# EAGLE design protect_clamp (EAGLE 9.2.2)
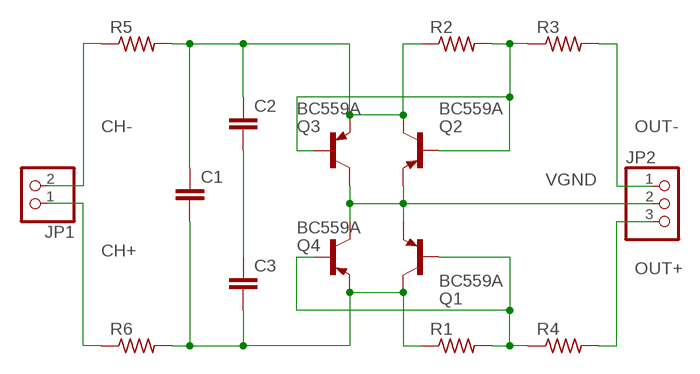
[diagram p0: schematic, sheet 1]

## Parts
C1  C2.5/2  [C2.5-2]
C2  C2.5/2  [C2.5-2]
C3  C2.5/2  [C2.5-2]
JP1  PINHD-1X2  [1X02]
JP2  PINHD-1X3  [1X03]
Q1  BC559A  [TO92-EBC]
Q2  BC559A  [TO92-EBC]
Q3  BC559A  [TO92-EBC]
Q4  BC559A  [TO92-EBC]
R1  R-US_0204/5  [0204/5]
R2  R-US_0204/5  [0204/5]
R3  R-US_0204/5  [0204/5]
R4  R-US_0204/5  [0204/5]
R5  R-US_0204/5  [0204/5]
R6  R-US_0204/5  [0204/5]

## Nets
CH+: JP1.1 R6.1
CH-: JP1.2 R5.1
N$2: Q1.B Q4.B R1.2 R4.1
N$3: Q2.B Q3.B R2.2 R3.1
N$4: C2.2 C3.1
N$6: C1.2 C3.2 Q1.C Q4.E R1.1 R6.2
N$7: C1.1 C2.1 Q2.C Q3.E R2.1 R5.2
OUT+: JP2.3 R4.2
OUT-: JP2.1 R3.2
VGND: JP2.2 Q1.E Q2.E Q3.C Q4.C

## Library data of the parts
C1-C3 = capacitor-wima:C: CAPACITOR naming: grid - package width
JP1 = pinhead:PINHD-1X2: PIN HEADER
JP2 = pinhead:PINHD-1X3: PIN HEADER
Q1-Q4 = transistor-pnp:BC559*: PNP Transistror
R1-R6 = rcl:R-US_: RESISTOR, American symbol; SPICEPREFIX: R

## Board
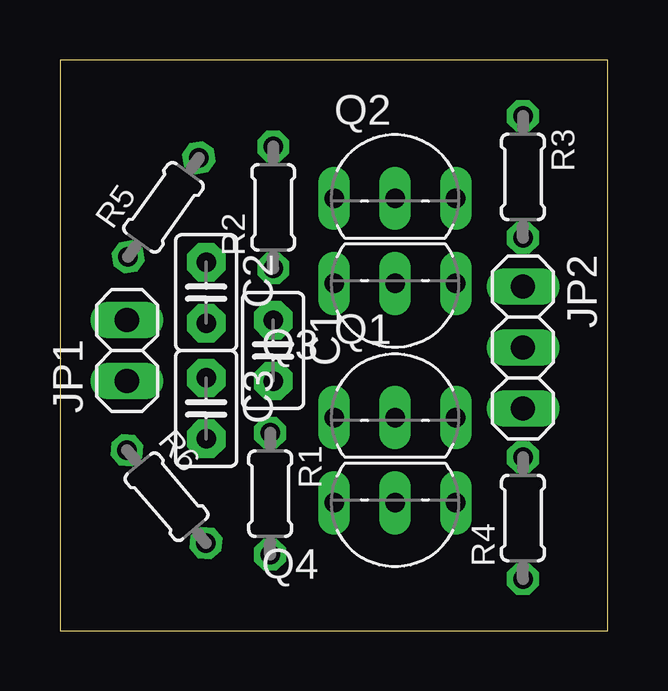
[diagram p1: board, top side]
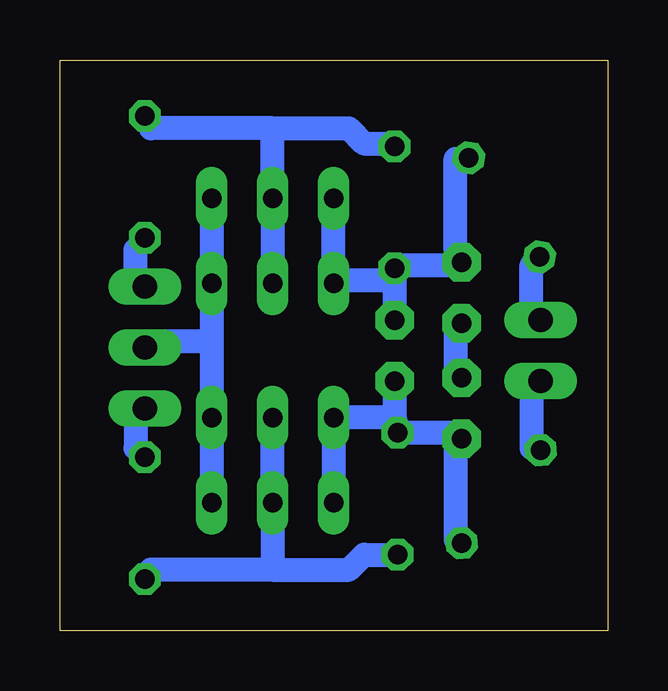
[diagram p2: board, bottom side, seen from below]

Size 22.84 x 23.8 mm. Coordinates in mm from the lower left corner, seen from the top.
Outline: 0,0 22.84,0 22.84,23.8 0,23.8 0,0
Copper layers (1*16): Top 0.035mm / dielectric 1.5mm / Bottom 0.035mm
Design rules "default *": minimum track width 1mm, minimum drill 0.35mm, track to track 0.6mm, track to pad 0.6mm, pad to pad 0.6mm, via to via 0.6mm, smd to smd 6mil, copper to edge 40mil, drill to drill 6mil, minimum pad ring 10mil, minimum via ring 8mil, stop-mask expansion 4mil, vias tented up to drill 0mil, thermal gap 10mil

### Footprints (pad centres in the part's own frame; a part is rotated, then mirrored left to right if it is on the bottom)
C2.5-2 = drill 0.813 pad 1.6 octagon: 1 -1.27,0; 2 1.27,0
1X02 = drill 1.016 long: 1 -1.27,0; 2 1.27,0
1X03 = drill 1.016 long: 1 -2.54,0; 2 0,0; 3 2.54,0
TO92-EBC = drill 0.813 long: B 0,-1.27; C -2.54,-1.27; E 2.54,-1.27
0204/5 = drill 0.813 octagon: 1 -2.54,0; 2 2.54,0

### Placement (x,y rotation side)
C1  8.89,11.68 270 top
C2  6.1,14.1 270 top
C3  6.1,9.27 270 top
JP1  2.79,11.68 90 top
JP2  19.3,11.81 270 top
Q1  13.97,10.16 0 top
Q2  13.97,19.3 0 top
Q3  13.97,13.21 180 top
Q4  13.97,4.06 180 top
R1  8.76,5.71 270 top
R2  8.89,17.65 90 top
R3  19.3,18.92 270 top
R4  19.3,4.7 90 top
R5  4.32,17.65 54.5 top
R6  4.45,5.59 310.4 top

### Tracks (layer width: path | path; a pad name or v marks a point on that pad's centre or on a via)
CH+
  Bottom 1: R6.1 3.17,7.62 3.17,10.16 JP1.1
CH-
  Bottom 1: R5.1 3.17,15.24 3.17,13.34 JP1.2
N$2
  Bottom 1: R1.2 10.16,3.17 10.79,2.54 13.97,2.54 | 13.97,2.54 Q4.B Q1.B | 13.97,2.54 19.05,2.54 R4.1
N$3
  Bottom 1: 13.97,20.95 10.79,20.95 10.16,20.32 8.89,20.32 R2.2 | 13.97,20.95 Q2.B Q3.B | 13.97,20.95 19.05,20.95 R3.1
N$4
  Bottom 1: C3.1 6.35,10.79 6.35,12.7 C2.2
N$6
  Bottom 1: Q4.E Q1.C 8.89,8.89 | C1.2 8.89,8.89 | 8.89,8.89 8.89,8.26 R1.1 | R6.2 6.35,3.81 6.35,7.62 C3.2 6.35,8.26 R1.1 | 8.89,8.89 R1.1
N$7
  Bottom 1: R5.2 6.35,19.68 6.35,15.88 C2.1 6.35,15.24 8.89,15.24 R2.1 8.89,14.61 | 8.89,14.61 11.43,14.61 | 11.43,14.61 Q2.C | 11.43,14.61 Q3.E | 8.89,14.61 C1.1
OUT+
  Bottom 1: R4.2 19.68,7.62 19.68,8.89 JP2.3
OUT-
  Bottom 1: R3.2 19.68,15.88 19.68,14.61 JP2.1
VGND
  Bottom 1: Q4.C Q1.E 16.51,12.06 | Q2.E Q3.C 16.51,12.06 | 16.51,12.06 19.05,12.06 JP2.2